# EAGLE design AirU_PoE (EAGLE 9.5.2)
COMPANY: ADAFRUIT INDUSTRIES; DRAWN: KTOWN; REV: B
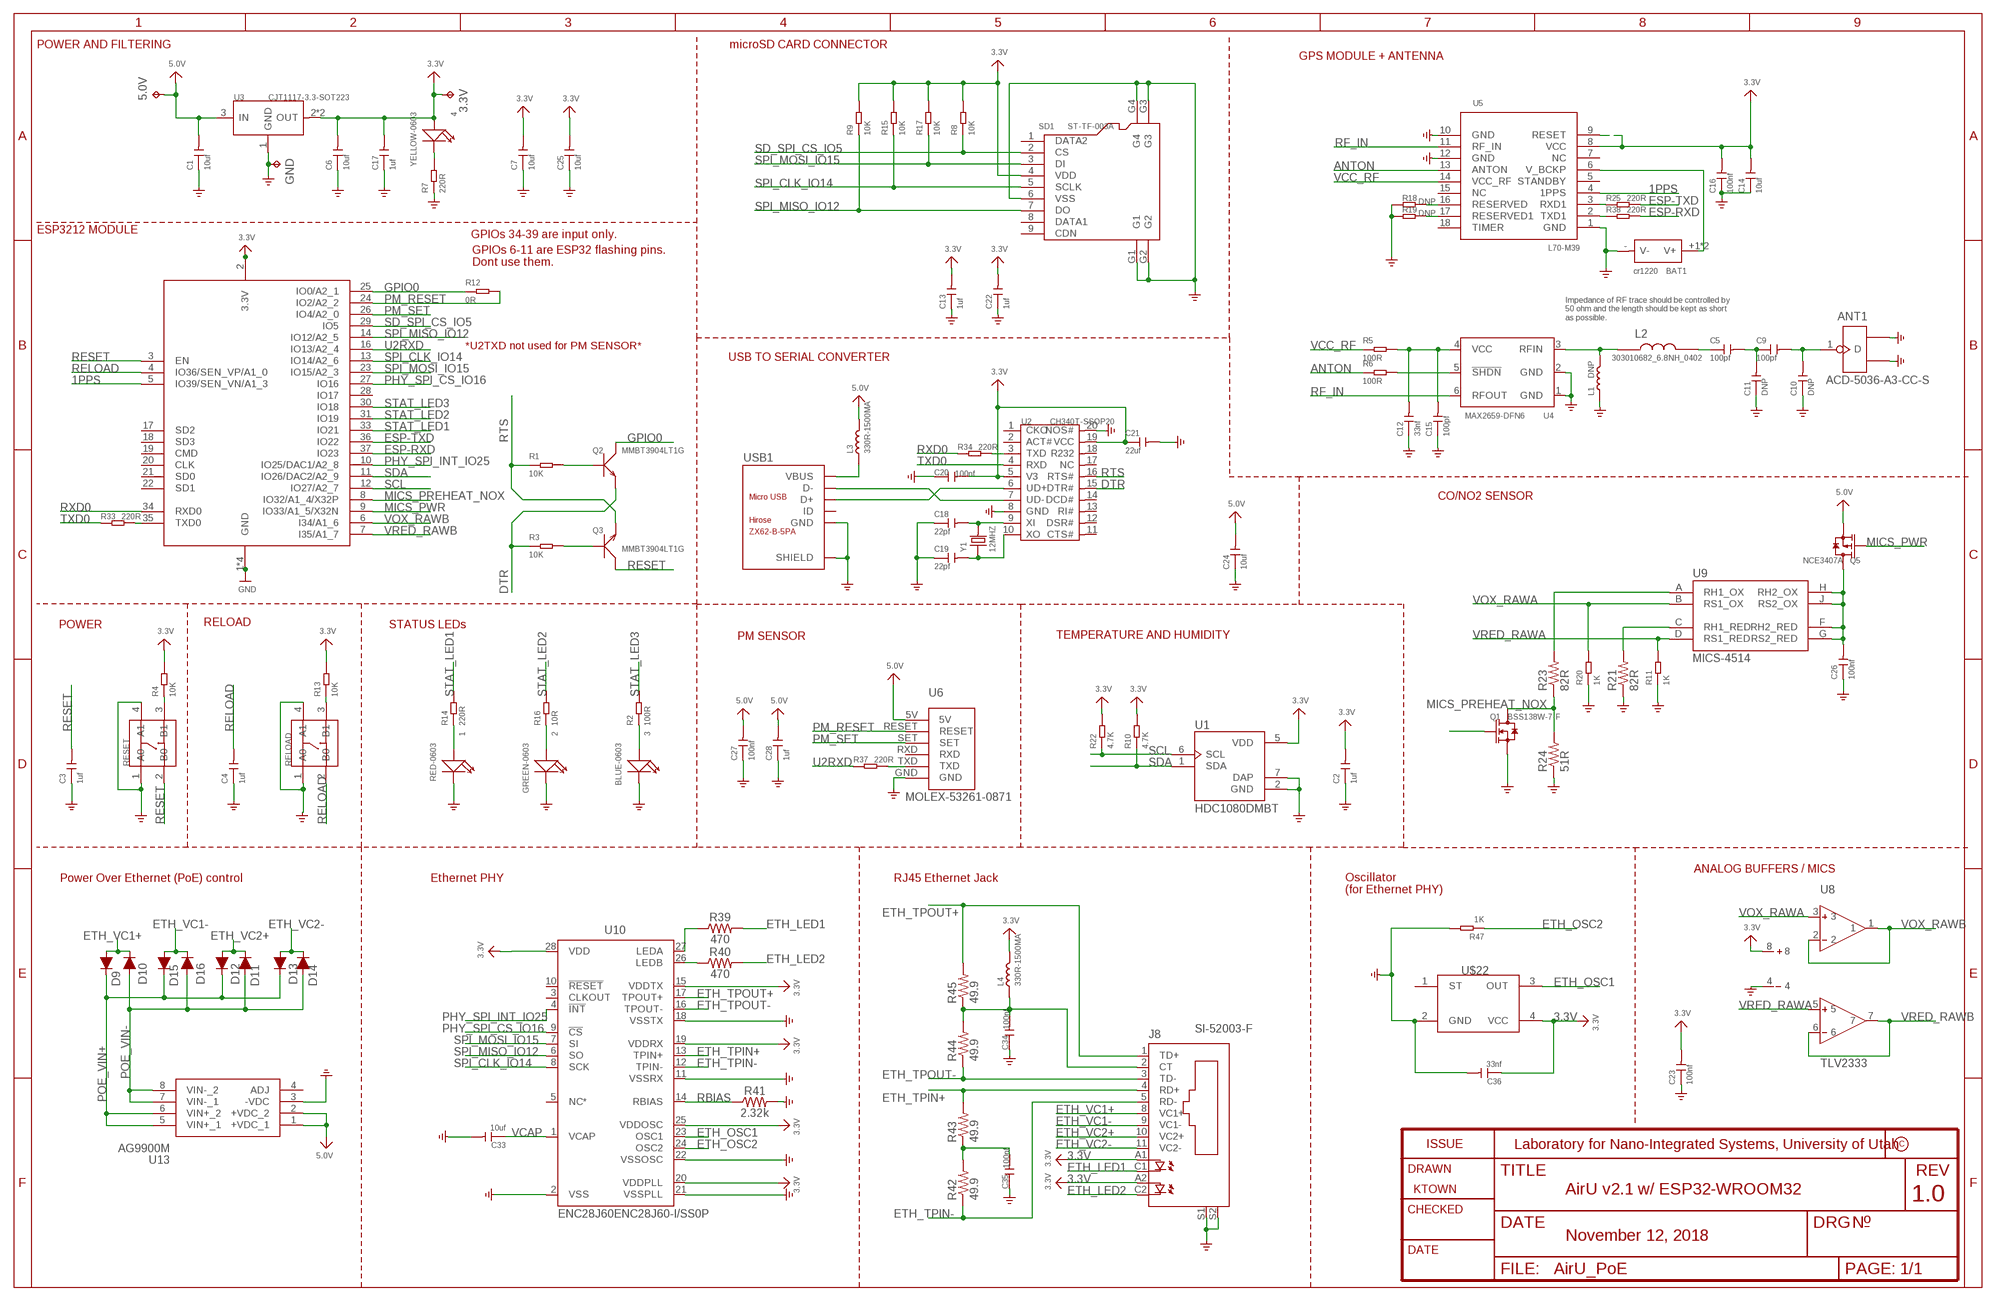
[diagram p0: schematic, sheet 1]
FRAME1 (FRAME_A4): COMPANY: TETRAD: SENSOR NETWORK SOLUTIONS, LLC; REV: 1.0

## Parts
1  RED-0603  LED-SMD-RED-DIFFUSED(0603)  [LED-0603]
2  GREEN-0603  SMD-LED-CLEAR-GREEN(0603)  [LED-0603]
3  BLUE-0603  SMD-LED-CLEAR-BLUE(0603)  [LED-0603]
3.3V  TPTP20SQ  [TP20SQ]
4  YELLOW-0603  SMD-LED-CLEAR-YELLOW(0603)  [LED-0603]
5.0V  TPTP20SQ  [TP20SQ]
ANT1  ACD-5036-A3-CC-S  ANTENNA-ACD5036  [ANT3-SMD-5.2X3.7X0.7MM]
BAT1  cr1220  DIP-BATTERY-CELL-HOLDER(1220)  [BAT2P-13.5-CR1220]
C1  10uf  CERAMIC-10UF-10V-10%-X5R(0603)  [C0603]
C2  1uf  CERAMIC-1UF-25V-10%-X7R(0603)  [C0603]
C3  1uf  CERAMIC-1UF-25V-10%-X7R(0603)  [C0603]
C4  1uf  CERAMIC-1UF-25V-10%-X7R(0603)  [C0603]
C5  100pf  CERAMIC-100PF-50V-5%-NPO(0603)  [C0603]
C6  10uf  CERAMIC-10UF-10V-10%-X5R(0603)  [C0603]
C7  10uf  CERAMIC-10UF-10V-10%-X5R(0603)  [C0603]
C9  100pf  CERAMIC-100PF-50V-5%-NPO(0603)  [C0603]
C10  DNP  CERAMIC-100PF-50V-5%-NPO(0603)  [C0603]
C11  DNP  CERAMIC-100PF-50V-5%-NPO(0603)  [C0603]
C12  33nf  CERAMIC-33NF-50V-10%-X7R(0603)  [C0603]
C13  1uf  CERAMIC-1UF-25V-10%-X7R(0603)  [C0603]
C14  10uf  CERAMIC-10UF-10V-10%-X5R(0603)  [C0603]
C15  100pf  CERAMIC-100PF-50V-5%-NPO(0603)  [C0603]
C16  100nf  CERAMIC-100NF-50V-10%-X7R(0603)  [C0603]
C17  1uf  CERAMIC-1UF-25V-10%-X7R(0603)  [C0603]
C18  22pf  CERAMIC-22PF-50V-5%-NPO(0603)  [C0603]
C19  22pf  CERAMIC-22PF-50V-5%-NPO(0603)  [C0603]
C20  100nf  CERAMIC-100NF-50V-10%-X7R(0603)  [C0603]
C21  22uf  CERAMIC-22UF-6.3V-20%-X5R(0805)  [C0805]
C22  1uf  CERAMIC-1UF-25V-10%-X7R(0603)  [C0603]
C23  100nf  CERAMIC-100NF-50V-10%-X7R(0603)  [C0603]
C24  10uf  CERAMIC-10UF-10V-10%-X5R(0603)  [C0603]
C25  10uf  CERAMIC-10UF-10V-10%-X5R(0603)  [C0603]
C26  100nf  CERAMIC-100NF-50V-10%-X7R(0603)  [C0603]
C27  100nf  CERAMIC-100NF-50V-10%-X7R(0603)  [C0603]
C28  1uf  CERAMIC-1UF-25V-10%-X7R(0603)  [C0603]
C33  10uf  CERAMIC-10UF-10V-10%-X5R(0603)  [C0603]
C34  100nf  CERAMIC-100NF-50V-10%-X7R(0603)  [C0603]
C35  100nf  CERAMIC-100NF-50V-10%-X7R(0603)  [C0603]
C36  33nf  CERAMIC-33NF-50V-10%-X7R(0603)  [C0603]
D9  250mA/100V  DIODE-BAS16J  [SOD-323]
D10  250mA/100V  DIODE-BAS16J  [SOD-323]
D11  250mA/100V  DIODE-BAS16J  [SOD-323]
D12  250mA/100V  DIODE-BAS16J  [SOD-323]
D13  250mA/100V  DIODE-BAS16J  [SOD-323]
D14  250mA/100V  DIODE-BAS16J  [SOD-323]
D15  250mA/100V  DIODE-BAS16J  [SOD-323]
D16  250mA/100V  DIODE-BAS16J  [SOD-323]
GND  TPTP20SQ  [TP20SQ]
J8  SI-52003-F  [SI-52003-F]
L1  DNP  INDUCTOR/FERRITE-BEAD-0201  [L0201]
L2  303010682_6.8NH_0402  [L0402]
L3  330R-1500MA  SMD-FERRITE-BEAD-330R-1500MA(0805)'0805'  [L0805]
L4  330R-1500MA  SMD-FERRITE-BEAD-330R-1500MA(0805)'0805'  [L0805]
Q1  BSS138W-7-F  SMD-MOSFET-N-CH-50V-200MA-BSS138W-7-F(SOT-23)  [SOT-23]
Q2  MMBT3904LT1G  SMD-TRANSISTORS-NPN-40V-200MA-MMBT3904LT1G(SOT-23)  [SOT-23]
Q3  MMBT3904LT1G  SMD-TRANSISTORS-NPN-40V-200MA-MMBT3904LT1G(SOT-23)  [SOT-23]
Q5  NCE3407A  SMD-MOSFET-P-CH-VDC=30V-ID=4.3A-NCE3407A(SOT-23)  [SOT-23]
R1  10K  SMD-RES-10K-1%-1/10W(0603)  [R0603]
R2  100R  SMD-RES-100R-5%-1/10W(0603)  [R0603]
R3  10K  SMD-RES-10K-1%-1/10W(0603)  [R0603]
R4  10K  SMD-RES-10K-1%-1/10W(0603)  [R0603]
R5  100R  SMD-RES-100R-5%-1/10W(0603)  [R0603]
R6  100R  SMD-RES-100R-5%-1/10W(0603)  [R0603]
R7  220R  SMD-RES-220R-5%-1/10W(0603)  [R0603]
R8  10K  SMD-RES-10K-1%-1/10W(0603)  [R0603]
R9  10K  SMD-RES-10K-1%-1/10W(0603)  [R0603]
R10  4.7K  SMD-RES-4.7K-5%-1/10W(0603)  [R0603]
R11  1K  SMD-RES-1K-1%-1/10W(0603)  [R0603]
R12  0R  SMD-RES-0R-5%-1/10W(0603)  [R0603]
R13  10K  SMD-RES-10K-1%-1/10W(0603)  [R0603]
R14  220R  SMD-RES-220R-5%-1/10W(0603)  [R0603]
R15  10K  SMD-RES-10K-1%-1/10W(0603)  [R0603]
R16  10R  SMD-RES-10R-5%-1/10W(0603)  [R0603]
R17  10K  SMD-RES-10K-1%-1/10W(0603)  [R0603]
R18  DNP  SMD-RES-10K-1%-1/10W(0603)  [R0603]
R19  DNP  SMD-RES-10K-1%-1/10W(0603)  [R0603]
R20  1K  SMD-RES-1K-1%-1/10W(0603)  [R0603]
R21  82R  R-US_R0603  [R0603]
R22  4.7K  SMD-RES-4.7K-5%-1/10W(0603)  [R0603]
R23  82R  R-US_R0603  [R0603]
R24  51R  R-US_R0603  [R0603]
R25  220R  SMD-RES-220R-5%-1/10W(0603)  [R0603]
R33  220R  SMD-RES-220R-5%-1/10W(0603)  [R0603]
R34  220R  SMD-RES-220R-5%-1/10W(0603)  [R0603]
R37  220R  SMD-RES-220R-5%-1/10W(0603)  [R0603]
R38  220R  SMD-RES-220R-5%-1/10W(0603)  [R0603]
R39  470  470OHM-0603-1/10W-1%  [0603]
R40  470  470OHM-0603-1/10W-1%  [0603]
R41  2.32k  2.2KOHM-0603-1/10W-1%  [0603]
R42  49.9  R-US_M0805  [M0805]
R43  49.9  R-US_M0805  [M0805]
R44  49.9  R-US_M0805  [M0805]
R45  49.9  R-US_M0805  [M0805]
R47  1K  SMD-RES-1K-1%-1/10W(0603)  [R0603]
RELOAD  DIP-SWITCH-TACTILE-SPST-NO/TS-1109(4P-D6.0MM)'TS-1109'  [SW4-6.0X6.0X5.0MM]
RESET  DIP-SWITCH-TACTILE-SPST-NO/TS-1109(4P-D6.0MM)'TS-1109'  [SW4-6.0X6.0X5.0MM]
SD1  ST-TF-003A  MICRO-SD-CARD-SOCKET-9P(ST-TF-003A)  [MICRO-SD9+4P-SMD-16.1X14.5X1.85MM]
U1  HDC1080DMBT  [SON100P300X300X80-7N]
U2  CH340T-SSOP20  INTERFACE-CH340T(SSOP20)  [SSOP20-0.65-7.6X5.2MM]
U3  CJT1117-3.3-SOT223  PMIC-CJT1117-3.3(SOT223)  [SOT-223]
U4  MAX2659-DFN6  AMPLIFIER-MAX2659  [DFN6-0.5-1.5X1.2X0.72MM]
U5  L70-M39  MOUDLE-GPS-L70-HARDWARE  [LGA18-1.1-9.7X10.1X2.5MM]
U6  MOLEX-53261-0871  [MOLEX-53261-0871]
U7  ESP32_WROOM32_SKINNY  [WROOM32_SKINNY]
U8  TLV2333  [TLV2333]
U9  MICS-4514  [MICS_10-SMD]
U10  ENC28J60ENC28J60-I/SS0P  [SOP65P780X200-28]
U13  AG9900M  [AG9900M]
U$22  SPXO25MHZ7050-4P  [DFN700X500X150-4N]
USB1  ZX62-B-5PA  MICRO-USB-SMD(ZX62-B-5PA)  [MICRO-USB5+6P-SMD-0.65-AB]
Y1  12MHZ  SMD-CRYSTAL-12MHZ-20PF-20PPM-40R(2P-5.0X3.2MM)  [X2-SMD-5.0X3.2X1.3MM]

## Nets
1PPS: U5.4(1PPS) U7.5(IO39/SEN_VN/A1_3)
3.3V: 3.3V.TP 4.+ C2.2 C6.2 C7.2 C13.2 C14.2 C16.2 C17.2 C20.2 C21.1 C22.2 C23.2 C25.2 C36.1 J8.A1 J8.A2 L4.2 R4.2 R8.2 R9.2 R10.2 R13.2 R15.2 R17.2 R22.2 SD1.4(VDD) U1.5(VDD) U2.5(V3) U2.19(VCC) U3.2(OUT) U3.TER(OUT) U5.8(VCC) U5.9(RESET) U7.2(3.3V) U8.8 U10.15(VDDTX) U10.19(VDDRX) U10.20(VDDPLL) U10.25(VDDOSC) U10.28(VDD) U$22.4(VCC)
5.0V: 5.0V.TP C1.2 C24.2 C27.2 C28.2 L3.2 Q5.2(S) U3.3(IN) U6.5V U13.1(+VDC_1) U13.2(+VDC_2)
ANTON: R6.1 U5.13(ANTON)
DTR: Q2.2(E) R3.1 U2.15(DTR#)
ESP-RXD: R38.2 U7.37(IO23)
ESP-TXD: R25.2 U7.36(IO22)
ETH_LED1: J8.C1 R39.2
ETH_LED2: J8.C2 R40.2
ETH_OSC1: U10.23(OSC1) U$22.3(OUT)
ETH_OSC2: R47.1 U10.24(OSC2)
ETH_TPIN+: J8.4(RD+) R43.2 U10.13(TPIN+)
ETH_TPIN-: J8.5(RD-) R42.1 U10.12(TPIN-)
ETH_TPOUT+: J8.1(TD+) R45.2 U10.17(TPOUT+)
ETH_TPOUT-: J8.3(TD-) R44.1 U10.16(TPOUT-)
ETH_VC1+: D9.A D10.C J8.8(VC1+)
ETH_VC1-: D15.A D16.C J8.9(VC1-)
ETH_VC2+: D11.C D12.A J8.10(VC2+)
ETH_VC2-: D13.A D14.C J8.11(VC2-)
GND: 1.- 2.- 3.- ANT1.2(GND1) ANT1.3(GND2) BAT1.-(V-) C1.1 C2.1 C3.1 C4.1 C6.1 C7.1 C10.1 C11.1 C12.1 C13.1 C14.1 C15.1 C16.1 C17.1 C18.1 C19.1 C20.1 C21.2 C22.1 C23.1 C24.1 C25.1 C26.1 C27.1 C28.1 C33.2 C34.1 C35.1 C36.2 GND.TP J8.S1 J8.S2 L1.1 Q1.2(S) R7.1 R11.1 R18.1 R19.1 R20.1 R21.1 R24.1 R41.2 R47.2 RELOAD.1(A0) RELOAD.4(A1) RESET.1(A0) RESET.4(A1) SD1.6(VSS) SD1.G1 SD1.G2 SD1.G3 SD1.G4 U1.2(GND) U1.7(DAP) U2.8(GND) U2.20(NOS#) U3.1(GND) U4.1(GND) U4.2(GND) U5.1(GND) U5.10(GND) U5.12(GND) U6.GND U7.1(GND) U7.15(GND) U7.38(GND) U7.P$1(GND) U8.4 U10.2(VSS) U10.11(VSSRX) U10.18(VSSTX) U10.21(VSSPLL) U10.22(VSSOSC) U13.3(-VDC) U$22.2(GND) USB1.5(GND) USB1.P1(SHIELD) USB1.P2(SHIELD) USB1.P3_1(SHIELD) USB1.P3_2(SHIELD) USB1.P3_3(SHIELD) USB1.P4_1(SHIELD) USB1.P4_2(SHIELD) USB1.P4_3(SHIELD) USB1.P5(SHIELD) USB1.P6(SHIELD) ; supply symbol labelled GND_POWER
GPIO0: Q2.3(C) R12.1 U7.25(IO0/A2_1)
LEDA: R39.1 U10.27(LEDA)
LEDB: R40.1 U10.26(LEDB)
MICS_PREHEAT_NOX: Q1.1(G) U7.8(IO32/A1_4/X32P)
MICS_PWR: Q5.1(G) U7.9(IO33/A1_5/X32N)
N$1: 2.+ R16.1
N$2: R21.2 U9.C(RH1_RED)
N$3: C5.2 C9.1 C11.2
N$4: ANT1.1(D) C9.2 C10.2
N$5: L1.2 L2.P$1 U4.3(RFIN)
N$6: R23.2 U9.A(RH1_OX)
N$7: 1.+ R14.1
N$8: C5.1 L2.P$2
N$9: R6.2 U4.5(!SHDN)
N$10: C12.2 C15.2 R5.2 U4.4(VCC)
N$11: R18.2 U5.16(RESERVED)
N$12: Q3.1(B) R3.2
N$13: Q2.1(B) R1.2
N$14: R19.2 U5.17(RESERVED1)
N$22: 3.+ R2.1
N$23: Q1.3(D) R23.1 R24.2
N$24: C26.2 Q5.3(D) U9.F(RH2_RED) U9.G(RS2_RED) U9.H(RH2_OX) U9.J(RS2_OX)
N$25: 4.- R7.2
N$26: U2.7(UD-) USB1.2(D-)
N$27: U2.6(UD+) USB1.3(D+)
N$28: C18.2 U2.9(XI) Y1.2
N$29: C19.2 U2.10(XO) Y1.1
N$30: R34.2 U2.3(TXD)
N$33: R33.2 U7.35(TXD0)
N$36: R37.2 U6.TXD
N$37: R13.1 RELOAD.3(B1)
N$38: R4.1 RESET.3(B1)
N$43: C35.2 R42.2 R43.1
N$46: C34.2 J8.2(CT) L4.1 R44.2 R45.1
PHY_SPI_CS_IO16: U7.27(IO16) U10.9(!CS)
PHY_SPI_INT_IO25: U7.10(IO25/DAC1/A2_8) U10.4(!INT)
PM_RESET: R12.2 U6.RESET U7.24(IO2/A2_2)
PM_SET: U6.SET U7.26(IO4/A2_0)
POE_VIN+: D9.C D12.C D13.C D15.C U13.5(VIN+_1) U13.6(VIN+_2)
POE_VIN-: D10.A D11.A D14.A D16.A U13.7(VIN-_1) U13.8(VIN-_2)
RBIAS: R41.1 U10.14(RBIAS)
RELOAD: C4.2 RELOAD.2(B0) U7.4(IO36/SEN_VP/A1_0)
RESET: C3.2 Q3.3(C) RESET.2(B0) U7.3(EN)
RF_IN: U4.6(RFOUT) U5.11(RF_IN)
RTS: Q3.2(E) R1.1 U2.16(RTS#)
RXD0: R34.1 U7.34(RXD0)
SCL: R22.1 U1.6(SCL) U7.12(IO27/A2_7)
SD_SPI_CS_IO5: R8.1 SD1.2(CS) U7.29(IO5)
SDA: R10.1 U1.1(SDA) U7.11(IO26/DAC2/A2_9)
SPI_CLK_IO14: R15.1 SD1.5(SCLK) U7.13(IO14/A2_6) U10.8(SCK)
SPI_MISO_IO12: R9.1 SD1.7(DO) U7.14(IO12/A2_5) U10.6(SO)
SPI_MOSI_IO15: R17.1 SD1.3(DI) U7.23(IO15/A2_3) U10.7(SI)
STAT_LED1: R14.2 U7.33(IO21)
STAT_LED2: R16.2 U7.31(IO19)
STAT_LED3: R2.2 U7.30(IO18)
TXD0: R33.1 U2.4(RXD)
U1RXD: R25.1 U5.3(RXD1)
U1TXD: R38.1 U5.2(TXD1)
U2RXD: R37.1 U7.16(IO13/A2_4)
V_BCKP: BAT1.+1(V+) BAT1.+2(V+) U5.6(V_BCKP)
VBUS: L3.1 USB1.1(VBUS)
VCAP: C33.1 U10.1(VCAP)
VCC_RF: R5.1 U5.14(VCC_RF)
VOX_RAWA: R20.2 U8.3 U9.B(RS1_OX)
VOX_RAWB: U7.6(I34/A1_6) U8.1 U8.2
VRED_RAWA: R11.2 U8.5 U9.D(RS1_RED)
VRED_RAWB: U7.7(I35/A1_7) U8.6 U8.7
Unconnected: SD1.1(DATA2) SD1.8(DATA1) SD1.9(CDN) U2.1(CKO) U2.2(ACT#) U2.11(CTS#) U2.12(DSR#) U2.13(RI#) U2.14(DCD#) U2.17(NC) U2.18(R232) U5.5(STANDBY) U5.7(NC) U5.15(NC) U5.18(TIMER) U6.RXD U7.17(SD2) U7.18(SD3) U7.19(CMD) U7.20(CLK) U7.21(SD0) U7.22(SD1) U7.28(IO17) U10.3(CLKOUT) U10.5(NC*) U10.10(!RESET) U13.4(ADJ) U$22.1(ST) USB1.4(ID)

## Notes on the sheet
- POWER AND FILTERING | microSD CARD CONNECTOR
- GPS MODULE + ANTENNA
- ESP3212 MODULE
- GPIOs 34-39 are input only.
- GPIOs 6-11 are ESP32 flashing pins.
  Dont use them.
- Impedance of RF trace should be controlled by 
  50 ohm and the length should be kept as short 
  as possible.
- *U2TXD not used for PM SENSOR*
- USB TO SERIAL CONVERTER
- CO/NO2 SENSOR
- POWER | RELOAD | STATUS LEDs
- PM SENSOR | TEMPERATURE AND HUMIDITY
- ANALOG BUFFERS / MICS
- Power Over Ethernet (PoE) control | Ethernet PHY | RJ45 Ethernet Jack
- Oscillator
  (for Ethernet PHY)
- Laboratory for Nano-Integrated Systems, University of Utah
- AirU v2.1 w/ ESP32-WROOM32
- November 12, 2018

## Library data of the parts
1 = Seeed-LED:LED-SMD-RED-DIFFUSED(0603): 304090042; MPN: 19-217-R6C-AL1M2VY-3T
2 = Seeed-LED:SMD-LED-CLEAR-GREEN(0603): 304090043; MPN: 19-217-G7C-AN1P2-3T
3 = Seeed-LED:SMD-LED-CLEAR-BLUE(0603): 304090045; MPN: 19-217-BHC-ZL1M2RY-3T
3.3V 5.0V GND = testpad:TP: Test pad
4 = Seeed-LED:SMD-LED-CLEAR-YELLOW(0603): 304090044; MPN: 19-217-Y5C-AM1N1VY-3T
ANT1 = Connector-new:ANTENNA-ACD5036; MPN: ACD-5036-A3-CC-S
BAT1 = Seeed-Connector:DIP-BATTERY-CELL-HOLDER(1220): 320170002
C1 C6 C7 C14 C24 C25 C33 = Seeed-Capacitor:CERAMIC-10UF-10V-10%-X5R(0603): 302010103; MPN: CC0603KRX5R6BB106
C2-C4 C13 C17 C22 C28 = Seeed-Capacitor:CERAMIC-1UF-25V-10%-X7R(0603): 302010139; MPN: CC0603KRX7R8BB105
C5 C9 C15 = Seeed-Capacitor:CERAMIC-100PF-50V-5%-NPO(0603): 302010076; MPN: CC0603JRNPO9BN101
C10 C11 = Seeed-Capacitor:CERAMIC-100PF-50V-5%-NPO(0603): 302010076; MPN: CC0603JRNPO9BN101; VALUE: 100pf
C12 C36 = Seeed-Capacitor:CERAMIC-33NF-50V-10%-X7R(0603): 302010088; MPN: CC0603KRX7R9BB333
C16 C20 C23 C26 C27 C34 C35 = Seeed-Capacitor:CERAMIC-100NF-50V-10%-X7R(0603): 302010138; MPN: CC0603KRX7R9BB104
C18 C19 = Seeed-Capacitor:CERAMIC-22PF-50V-5%-NPO(0603): 302010143; MPN: CC0603JRNPO9BN220
C21 = Seeed-Capacitor:CERAMIC-22UF-6.3V-20%-X5R(0805): 302010171; MPN: CC0805MKX5R5BB226
D9-D16 = SparkFun-DiscreteSemi:DIODE: Diode These are standard reverse protection diodes and small signal diodes. SparkFun Products: SparkFun SparkPunk Sound Kit <https://www.sparkfun.com/products/11177> SparkFun ESP8266 Thing <https://www.sparkfun.com/products/13231>; PROD_ID: DIO-09646
J8 = SI-52003-F:SI-52003-F: Ethernet Connector MagJack (R) Source: www.stewartconnector.com .. si-50170.pdf; AVAILABILITY: Unavailable; DESCRIPTION: Conn RJ-45 F 8 POS Solder RA Thru-Hole 12 Terminal 1 Port; MF: Stewart Connector; MP: SI-52003-F; PACKAGE: None; PRICE: None
L1 = Discrete-new:INDUCTOR/FERRITE-BEAD
L2 = Seeed-OPL-2017-01-Inductor-Akita:303010682_6.8NH_0402: Murata;LQW15AN6N8G00D, SMD Inductor 6.8nH-2%-700mA;0402, SKU: 303010682
L3 L4 = Seeed-Inductor:SMD-FERRITE-BEAD-330R-1500MA(0805): 303030006; MPN: BLM21PG331SN1D
Q1 = Seeed-Transistor:SMD-MOSFET-N-CH-50V-200MA-BSS138W-7-F(SOT-23): 305030000; MPN: BSS138W-7-F
Q2 Q3 = Seeed-Transistor:SMD-TRANSISTORS-NPN-40V-200MA-MMBT3904LT1G(SOT-23): 305010013; MPN: MMBT3904LT1G
Q5 = Seeed-Transistor:SMD-MOSFET-P-CH-VDC=30V-ID=4.3A-NCE3407A(SOT-23): 305030010; MPN: NCE3407A
R1 R3 R4 R8 R9 R13 R15 R17 = Seeed-Resistor:SMD-RES-10K-1%-1/10W(0603): 301010299; MPN: RC0603FR-0710KL
R2 R5 R6 = Seeed-Resistor:SMD-RES-100R-5%-1/10W(0603): 301010090; MPN: RC0603JR-07100RL
R7 R14 R25 R33 R34 R37 R38 = Seeed-Resistor:SMD-RES-220R-5%-1/10W(0603): 301010163; MPN: RC0603JR-07220RL
R10 R22 = Seeed-Resistor:SMD-RES-4.7K-5%-1/10W(0603): 301010290; MPN: RC0603JR-074K7L
R11 R20 R47 = Seeed-Resistor:SMD-RES-1K-1%-1/10W(0603): 301010298; MPN: RC0603FR-071KL
R12 = Seeed-Resistor:SMD-RES-0R-5%-1/10W(0603): 301010292; MPN: RC0603JR-070RL
R16 = Seeed-Resistor:SMD-RES-10R-5%-1/10W(0603): 301010096; MPN: RC0603JR-0710RL
R18 R19 = Seeed-Resistor:SMD-RES-10K-1%-1/10W(0603): 301010299; MPN: RC0603FR-0710KL; VALUE: 10K
R21 R23 R24 = rcl:R-US_: RESISTOR, American symbol; SPICEPREFIX: R
R39 R40 = SparkFun-Resistors:470OHM: 470Ω resistor A resistor is a passive two-terminal electrical component that implements electrical resistance as a circuit element. Resistors act to reduce current flow, and, at the same time, act to lower voltage levels within circuits. - Wikipedia; PROD_ID: RES-07869
R41 = SparkFun-Resistors:2.2KOHM: 2.2kΩ resistor A resistor is a passive two-terminal electrical component that implements electrical resistance as a circuit element. Resistors act to reduce current flow, and, at the same time, act to lower voltage levels within circuits. - Wikipedia; PROD_ID: RES-08272; VALUE: 2.2k
R42-R45 = BeagleBone_Black_Wireless:R-US_: RESISTOR, American symbol
RELOAD RESET = Seeed-Switch:DIP-SWITCH-TACTILE-SPST-NO/TS-1109(4P-D6.0MM): 311020024
SD1 = Seeed-Connector:MICRO-SD-CARD-SOCKET-9P(ST-TF-003A): 320090000; MPN: ST-TF-003A
U1 = HDC1080DMBT_TITempHum:HDC1080DMBT: HDC1080 Low Power, High Accuracy Digital Humidity Sensor with Temperature Sensor 6-WSON -40 to 125; DESCRIPTION: HDC1080 Low Power, High Accuracy Digital Humidity Sensor with Temperature Sensor 6-WSON -40 to 125; DIGI-KEY_PART_NUMBER: 296-43864-1-ND; DIGI-KEY_PURCHASE_URL: https://www.digikey.com/product-detail/en/texas-instruments/HDC1080DMBT/296-43864-1-ND/5878615?utm_source=snapeda&utm_medium=aggregator&utm_campaign=symbol; MF: Texas Instruments; MP: HDC1080DMBT; PACKAGE: WDFN-6 Texas Instruments
U2 = Seeed-IC:INTERFACE-CH340T(SSOP20): 310070026; MPN: CH340T
U3 = Seeed-IC:PMIC-CJT1117-3.3(SOT223): 310030097; MPN: CJT1117-3.3
U4 = IC-new:AMPLIFIER-MAX2659: GPS/GNSS Low-Noise Amplifier; MPN: MAX2659
U5 = moudle-new:MOUDLE-GPS-L70-HARDWARE: L70 GPS module; MPN: L70; VALUE: L70
U6 = Molex_53261_0871_Connector:MOLEX-53261-0871
U7 = microbuilder:ESP32_WROOM32
U8 = tlv2333:TLV2333
U9 = MICS-4514:MICS-4514: Metal oxide MEMS carbon monoxide (CO) and NOx sensor in an SMD package.; AVAILABILITY: Unavailable; MF: Amphenol; MP: MICS-4514; PACKAGE: None; PRICE: 11.82 USD
U10 = ENC28J60QFN:ENC28J60: Stand-Alone Ethernet Controller with SPI Interface Source: http://ww1.microchip.com/downloads/en/DeviceDoc/39662c.pdf
U13 = Ag9900M:AG9900M: Ultra Miniature PoE Module Source: Datasheet <https://www.silvertel.com/images/datasheets/Ag9900M-datasheet-ultra-miniature-isolated-Power-over-Ethernet-POE-module.pdf>; DESCRIPTION: Ultra Miniature PoE Module; HEIGHT: 13mm; MANUFACTURER_NAME: Silvertel; MANUFACTURER_PART_NUMBER: Ag9900M
U$22 = 25MHZ_seeed:SPXO25MHZ7050-4P
USB1 = Seeed-Connector:MICRO-USB-SMD(ZX62-B-5PA): 320010005; MPN: ZX62-B-5PA
Y1 = Seeed-Crystal Oscillator:SMD-CRYSTAL-12MHZ-20PF-20PPM-40R(2P-5.0X3.2MM): 306010047; MPN: 5032/2P

## Board
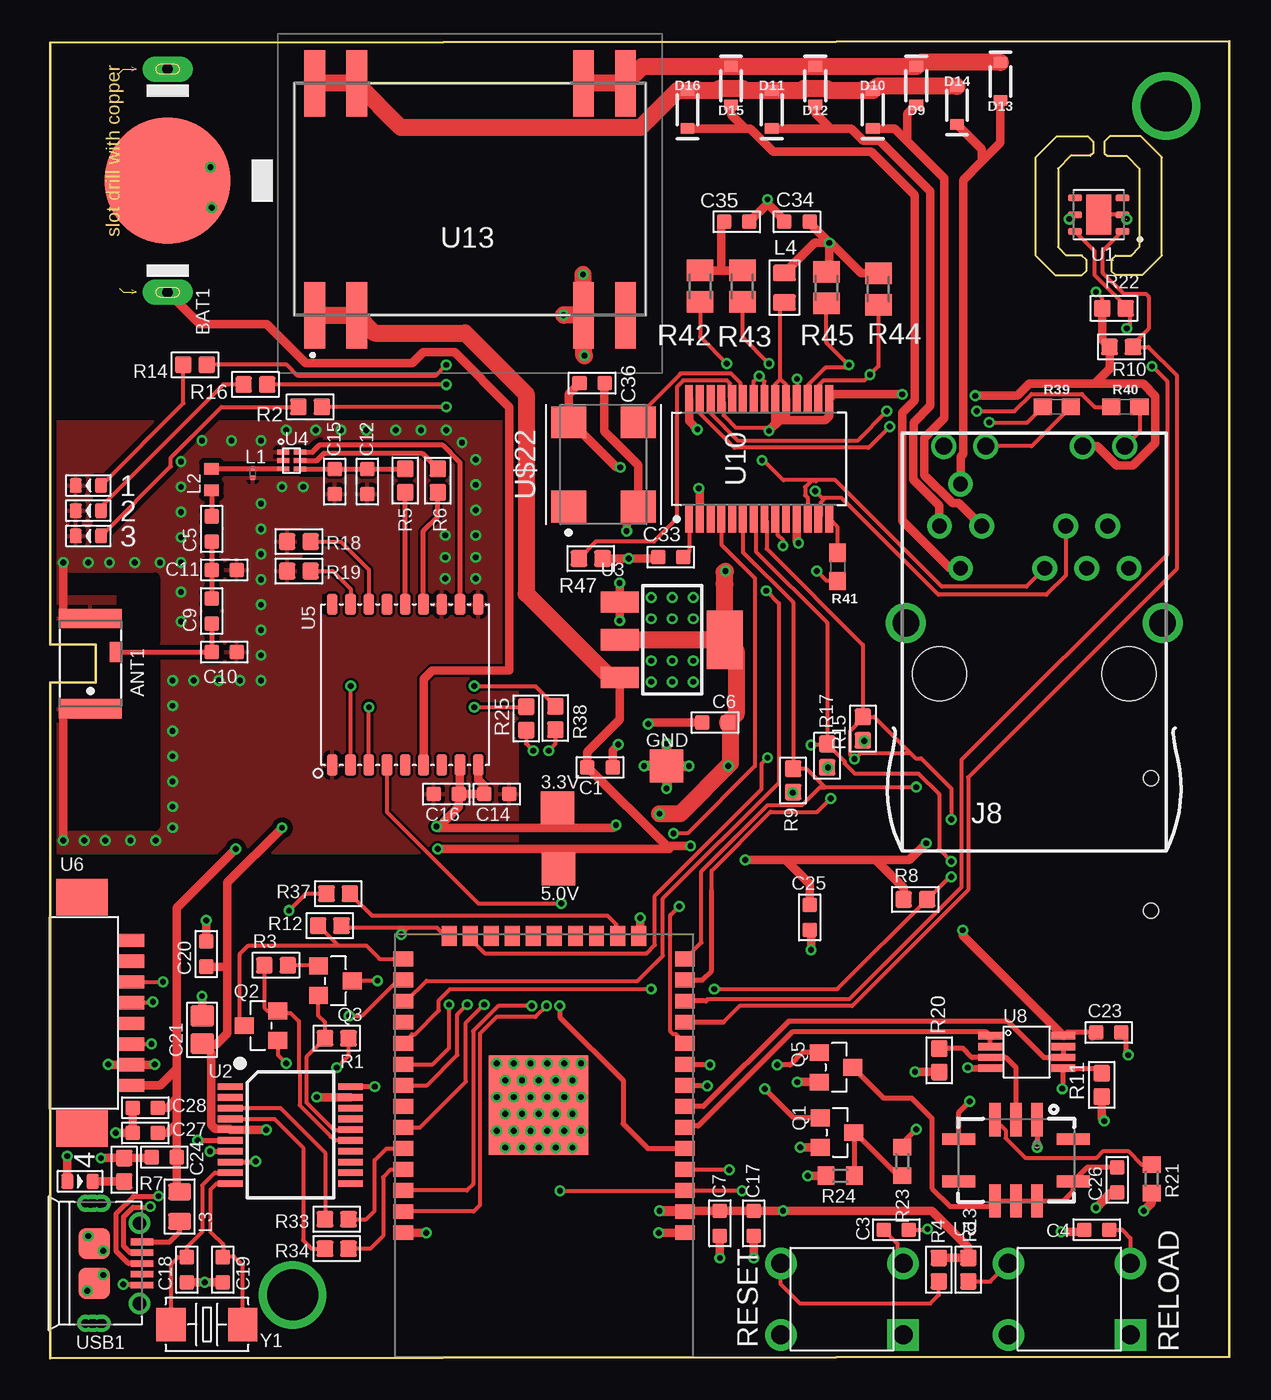
[diagram p1: board, top side]
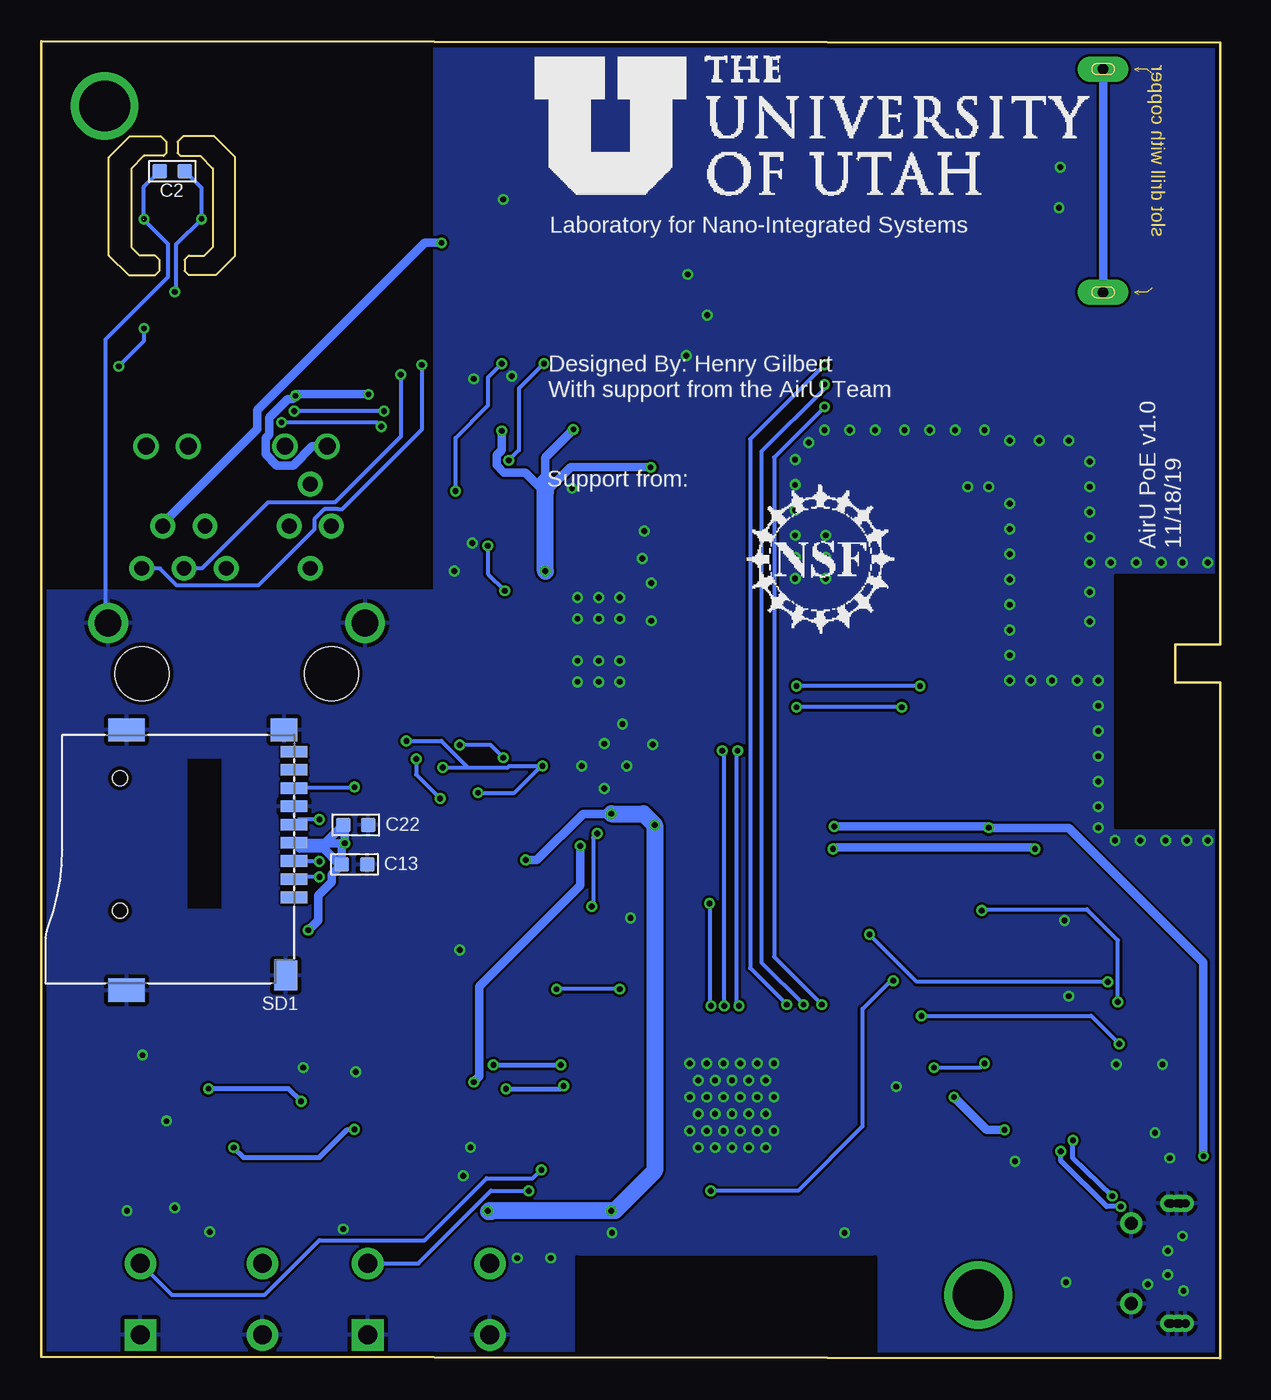
[diagram p2: board, bottom side, seen from below]

Size 71.12 x 79.46 mm. Coordinates in mm from the lower left corner, seen from the top.
Outline: 0,0 71.12,0.09 71.12,79.46 0,79.38 0,43.05 2.73,43.05 2.73,40.77 0,40.77 0,0
Outline: 63.58,73.4 63.58,72.72 63.75,72.55 64.93,72.55 65.69,71.79 65.69,67.05 65.19,66.54 64.26,66.54 64,66.29 64,65.61 64.26,65.36 65.86,65.36 67.05,66.54 67.05,72.47 65.78,73.74 63.92,73.74 63.58,73.4
Outline: 62.9,73.4 62.9,72.72 62.73,72.55 61.55,72.55 60.78,71.79 60.78,67.05 61.29,66.54 62.22,66.54 62.48,66.29 62.48,65.61 62.22,65.36 60.62,65.36 59.43,66.54 59.43,72.47 60.7,73.74 62.56,73.74 62.9,73.4
Copper layers (1*16): Top 0.035mm / dielectric 1.5mm / Bottom 0.035mm
Design rules "SeeedStudio_2layer_DRU_no_angle_20140221": minimum track width 6mil, minimum drill 12mil, track to track 6mil, track to pad 6mil, pad to pad 6mil, via to via 6mil, smd to smd 0mil, copper to edge 10mil, drill to drill 10mil, minimum pad ring 10mil, minimum via ring 6mil, stop-mask expansion 2mil, vias tented up to drill 100mil, thermal gap 10mil
tRestrict: area 20.8,0.1 to 38.8,6.1
bRestrict: area 20.8,0.1 to 38.8,6.1; area 0,32.1 to 6.3,47.1; area 0,32 to 6.3,47.2

### Footprints (pad centres in the part's own frame; a part is rotated, then mirrored left to right if it is on the bottom)
LED-0603 = smd 0.762 x 0.889: + -0.762,0; - 0.762,0
TP20SQ = smd 2 x 2: TP 0,0
ANT3-SMD-5.2X3.7X0.7MM = smd 0.75 x 1.2: 1 1.525,0.7 | smd 3.8 x 1.15: 2 0,2.725; 3 0,-2.725
BAT2P-13.5-CR1220 = drill 0.635 pad 1.524 long: +1 6.731,0; +2 -6.731,0 | smd 7.62 x 7.62: - 0,0
C0603 = smd 0.889 x 0.889: 1 0,0.762; 2 0,-0.762
C0805 = smd 1.397 x 1.27: 1 0,0.835; 2 0,-0.835
SOD-323 = smd 0.63 x 0.83: A 1.15,0; C -1.15,0
SI-52003-F = drill 0.9 pad 1.5: 1 5.715,3.302; 2 4.445,5.842; 3 3.175,3.302; 4 1.905,5.842; 5 0.635,3.302; 8 -3.175,5.842; 9 -4.445,3.302; 10 -5.715,5.842; 11 -4.445,8.382 | drill 1.016 pad 1.5: A1 -5.461,10.668; A2 2.921,10.668; C1 -2.921,10.668; C2 5.461,10.668 | drill 1.6 pad 2.2: S1 -7.747,0; S2 7.747,0 | hole 3.251: -5.715,-3.048; 5.715,-3.048
L0201 = smd 0.279 x 0.318: 1 -0.279,0; 2 0.279,0
L0402 = smd 0.7 x 0.9: P$1 -0.65,0; P$2 0.65,0
L0805 = smd 1.016 x 1.397: 1 -0.889,0; 2 0.889,0
SOT-23 = smd 1.016 x 1.143: 1 -0.889,-1.016; 2 0.889,-1.016; 3 0,1.016
R0603 = smd 1.016 x 1.016: 1 0,0.708; 2 0,-0.708
R0603' = smd 1 x 1.1: 1 -0.85,0; 2 0.85,0
0603 = smd 1.1 x 1: 1 -0.85,0; 2 0.85,0
M0805 = smd 1.3 x 1.6: 1 -0.95,0; 2 0.95,0
SW4-6.0X6.0X5.0MM = drill 1.143 pad 1.905 square: 1 -3.683,2.159 | drill 1.143 pad 1.905: 2 -3.683,-2.159; 3 3.683,-2.159; 4 3.683,2.159
MICRO-SD9+4P-SMD-16.1X14.5X1.85MM = smd 1.6 x 0.7: 1 0,2.25; 2 0,1.15; 3 0,0.05; 4 0,-1.05; 5 0,-2.15; 6 0,-3.25; 7 0,-4.35; 8 0,-5.45; 9 0,-6.55 | smd 1.6 x 1.4: G1 0.6,-7.85 | smd 2.2 x 1.4: G2 10.1,-7.85; G3 10.1,7.85 | smd 1.4 x 1.8: G4 0.5,6.95 | hole 0.9: 10.5,-4.95; 10.5,3.05
SON100P300X300X80-7N = smd 0.86 x 0.42: 1 -1.435,1; 2 -1.435,0; 3 -1.435,-1; 4 1.435,-1; 5 1.435,0; 6 1.435,1 | smd 1.5 x 2.4: 7 0,0
SSOP20-0.65-7.6X5.2MM = smd 0.4 x 1.5: 1 -2.925,-3.625; 2 -2.275,-3.625; 3 -1.625,-3.625; 4 -0.975,-3.625; 5 -0.325,-3.625; 6 0.325,-3.625; 7 0.975,-3.625; 8 1.625,-3.625; 9 2.275,-3.625; 10 2.925,-3.625; 11 2.925,3.625; 12 2.275,3.625; 13 1.625,3.625; 14 0.975,3.625; 15 0.325,3.625; 16 -0.325,3.625; 17 -0.975,3.625; 18 -1.625,3.625; 19 -2.275,3.625; 20 -2.925,3.625
SOT-223 = smd 1.27 x 2.286: 1 -2.286,-3.175; 2 0,-3.175; 3 2.286,-3.175 | smd 3.556 x 2.159: TER 0,3.175
DFN6-0.5-1.5X1.2X0.72MM = smd 0.3 x 0.75: 1 -0.5,-0.5; 2 0,-0.5; 3 0.5,-0.5; 4 0.5,0.5; 5 0,0.5; 6 -0.5,0.5
LGA18-1.1-9.7X10.1X2.5MM = smd 1.27 x 0.635: 1 4.85,-4.4; 2 4.85,-3.3; 3 4.85,-2.2; 4 4.85,-1.1; 5 4.85,0; 6 4.85,1.1; 7 4.85,2.2; 8 4.85,3.3; 9 4.85,4.4; 10 -4.85,4.4; 11 -4.85,3.3; 12 -4.85,2.2; 13 -4.85,1.1; 14 -4.85,0; 15 -4.85,-1.1; 16 -4.85,-2.2; 17 -4.85,-3.3; 18 -4.85,-4.4
MOLEX-53261-0871 = smd 0.8 x 1.6: 5V 4.375,0.8; GND 3.125,0.8; NC@1 -4.375,0.8; NC@2 -3.125,0.8; RESET -1.875,0.8; RXD 0.625,0.8; SET 1.875,0.8; TXD -0.625,0.8 | smd 2.2 x 3.1: NC@3 -6.975,-2.16; NC@4 6.975,-2.16
WROOM32_SKINNY = smd 1.2 x 0.9: 1 -8.5,5; 2 -8.5,3.73; 3 -8.5,2.46; 4 -8.5,1.19; 5 -8.5,-0.08; 6 -8.5,-1.35; 7 -8.5,-2.62; 8 -8.5,-3.89; 9 -8.5,-5.16; 10 -8.5,-6.43; 11 -8.5,-7.7; 12 -8.5,-8.97; 13 -8.5,-10.24; 14 -8.5,-11.51; 25 8.5,-11.51; 26 8.5,-10.24; 27 8.5,-8.97; 28 8.5,-7.7; 29 8.5,-6.43; 30 8.5,-5.16; 31 8.5,-3.89; 32 8.5,-2.62; 33 8.5,-1.35; 34 8.5,-0.08; 35 8.5,1.19; 36 8.5,2.46; 37 8.5,3.73; 38 8.5,5 | smd 0.9 x 1.2: 15 -5.7,-12.9; 16 -4.43,-12.9; 17 -3.16,-12.9; 18 -1.89,-12.9; 19 -0.62,-12.9; 20 0.65,-12.9; 21 1.92,-12.9; 22 3.19,-12.9; 23 4.46,-12.9; 24 5.73,-12.9 | smd 6 x 6: P$1 0.34,-2.7
TLV2333 = smd 1.45 x 0.45: 1 0.725,2.175; 2 0.725,1.525; 3 0.725,0.875; 4 0.725,0.225; 5 5.125,0.225; 6 5.125,0.875; 7 5.125,1.525; 8 5.125,2.175
MICS_10-SMD = smd 0.7 x 2: A 1.27,2.45; B 0,2.45; C -1.27,2.45; F -1.27,-2.45; G 0,-2.45; H 1.27,-2.45 | smd 2 x 0.7: D -3.45,1.27; E -3.45,-1.27; J 3.45,-1.27; K 3.45,1.27
SOP65P780X200-28 = smd 1.702 x 0.475: 1 -3.603,4.225; 2 -3.603,3.575; 3 -3.603,2.925; 4 -3.603,2.275; 5 -3.603,1.625; 6 -3.603,0.975; 7 -3.603,0.325; 8 -3.603,-0.325; 9 -3.603,-0.975; 10 -3.603,-1.625; 11 -3.603,-2.275; 12 -3.603,-2.925; 13 -3.603,-3.575; 14 -3.603,-4.225; 15 3.603,-4.225; 16 3.603,-3.575; 17 3.603,-2.925; 18 3.603,-2.275; 19 3.603,-1.625; 20 3.603,-0.975; 21 3.603,-0.325; 22 3.603,0.325; 23 3.603,0.975; 24 3.603,1.625; 25 3.603,2.275; 26 3.603,2.925; 27 3.603,3.575; 28 3.603,4.225
AG9900M = smd 1.25 x 4: 1 -9.375,-7; 2 -6.835,-7; 3 6.835,-7; 4 9.375,-7; 5 9.375,7; 6 6.835,7; 7 -6.835,7; 8 -9.375,7
DFN700X500X150-4N = smd 1.912 x 2.112: 1 -2.54,2.1; 2 -2.54,-2.1; 3 2.54,-2.1; 4 2.54,2.1
MICRO-USB5+6P-SMD-0.65-AB = smd 0.4 x 1.35: 1 -1.3,2.875; 2 -0.65,2.875; 3 0,2.875; 4 0.65,2.875; 5 1.3,2.875 | smd 1.9 x 1.9: P1 -1.2,0; P2 1.2,0 | drill 0.508 pad 1.016: P3_1 -3.625,-0.533; P3_2 -3.625,-0.025; P3_3 -3.625,0.483; P4_1 3.625,-0.533; P4_2 3.625,-0.025; P4_3 3.625,0.483 | drill 0.8: P5 -2.425,2.73; P6 2.425,2.73
X2-SMD-5.0X3.2X1.3MM = smd 1.778 x 2.032: 1 -2.159,0; 2 2.159,0

### Placement (x,y rotation side)
1  2.29,52.66 180 top
2  2.29,51.14 180 top
3  2.29,49.61 180 top
3.3V  30.58,33.21 0 top
4  1.78,10.67 0 top
5.0V  30.65,29.52 0 top
ANT1  2.41,41.91 0 top
BAT1  7.07,71.06 270 top
C1  33.15,35.65 270 top
C2  63.23,71.62 90 bottom
C3  51.02,7.75 270 top
C4  63.12,7.75 90 top
C5  9.72,50.04 0 top
C6  40.09,38.35 90 top
C7  40.39,8.13 180 top
C9  9.72,45.09 0 top
C10  10.48,42.61 270 top
C11  10.48,47.56 270 top
C12  19.11,52.9 180 top
C13  52.24,29.8 270 bottom
C14  26.92,34.04 270 top
C15  17.14,52.9 180 top
C16  23.88,34.04 90 top
C17  42.42,8.13 180 top
C18  8.23,5.33 180 top
C19  10.39,5.33 180 top
C20  9.4,24.38 0 top
C21  9.14,19.81 180 top
C22  52.15,32.17 270 bottom
C23  63.84,19.64 270 top
C24  6.86,12.13 90 top
C25  45.8,26.59 180 top
C26  64.35,10.75 180 top
C27  5.71,13.59 90 top
C28  5.71,15.11 90 top
C33  37.42,48.34 270 top
C34  45.04,68.57 90 top
C35  41.4,68.57 270 top
C36  32.68,58.84 90 top
D9  52.23,76.79 270 top
D10  49.61,75.35 90 top
D11  43.51,75.35 90 top
D12  46.14,76.79 270 top
D13  57.31,77.04 270 top
D14  54.69,75.6 90 top
D15  41.06,76.79 270 top
D16  38.43,75.35 90 top
GND  37.16,35.73 0 top
J8  59.35,44.36 0 top
L1  12.19,53.4 90 top
L2  9.72,53.02 270 top
L3  7.79,9.14 90 top
L4  44.28,64.59 270 top
Q1  47.46,13.61 270 top
Q2  12.7,20.07 90 top
Q3  17.18,22.77 270 top
Q5  47.39,17.55 270 top
R1  17.27,19.3 90 top
R2  15.66,57.4 90 top
R3  13.61,23.71 90 top
R4  53.59,5.33 180 top
R5  21.4,52.96 180 top
R6  23.37,52.96 180 top
R7  4.45,11.37 0 top
R8  52.18,27.68 270 top
R9  44.8,34.86 0 top
R10  64.6,61.02 270 top
R11  63.42,16.49 180 top
R12  16.85,26.1 90 top
R13  55.37,5.33 180 top
R14  8.72,59.94 90 top
R15  49.01,37.99 0 top
R16  12.36,58.76 90 top
R17  46.85,36.36 0 top
R18  14.99,49.28 90 top
R19  14.99,47.5 90 top
R20  53.61,17.97 180 top
R21  82R  [R0603']  66.44,10.82 90 top
R22  64.16,63.35 270 top
R23  82R  [R0603']  51.39,11.87 90 top
R24  51R  [R0603']  47.65,11.01 0 top
R25  28.7,38.6 0 top
R33  17.27,6.6 90 top
R34  17.27,8.38 270 top
R37  17.36,28.02 270 top
R38  30.46,38.63 0 top
R39  60.7,57.4 0 top
R40  64.85,57.4 0 top
R41  47.49,47.75 270 top
R42  39.2,64.68 90 top
R43  41.74,64.68 270 top
R44  49.95,64.51 90 top
R45  46.82,64.6 270 top
R47  32.59,48.26 90 top
RELOAD  61.47,3.56 180 top
RESET  47.75,3.56 180 top
SD1  55.88,30.05 180 bottom
U1  63.24,69 180 top
U2  14.48,13.46 270 top
U3  37.51,43.35 270 top
U4  14.54,54.17 270 top
U5  21.4,40.64 270 top
U6  4.06,20.83 270 top
U7  29.78,12.57 180 top
U8  55.96,17.27 0 top
U9  58.25,11.94 0 top
U10  42.75,54.26 90 top
U13  25.31,69.93 0 top
U$22  33.36,53.93 90 top
USB1  2.65,5.71 270 top
Y1  9.44,2.03 180 top

### Tracks (layer width: path | path; a pad name or v marks a point on that pad's centre or on a via)
1PPS  (via drill 0.35)
  Top 0.254: U5.4 20.3,32.94 25.81,27.43 v30.82,27.43
  Top 0.305: v30.73,21.25 30.73,20.57 34.54,16.76 34.54,14.14 36.02,12.65 U7.5
  Bottom 0.254: v30.82,27.43 30.82,21.33 v30.73,21.25
3.3V  (via drill 0.35)
  Top 0.254: v13.01,13.79 v13.02,13.78 | U10.25 40.61,57.73 40.61,56.9 41.38,56.13 43.18,56.13 v43.34,55.96 | 43.72,56.51 U10.20 43.72,58.08 43.72,58.79 44.02,59.09 | 44.02,59.09 44.37,58.74 U10.19 | 44.02,59.09 44.02,63.45 L4.2 | v46.9,35.64 R17.2 | v40.89,35.73 40.89,38.32 C6.2 | R22.2 63.45,63.96 v63.07,64.34 | U1.5 61.54,68.74 v61.46,68.74
  Top 0.305: U8.8 61.28,19.64 C23.2
  Top 0.508: 23.45,32.09 v23.28,32.09 | U5.8 24.7,34.1 C16.2 | C16.2 24.64,33.27 23.45,32.09 | 23.45,32.09 23.37,32 30.22,32 | R4.2 R13.2 55.37,6.69 53.17,8.89 v44.2,8.89 C17.2 C7.2 38.33,8.89 U7.2 | 30.22,32 30.58,32 | 30.58,32 31.15,32 | v34.12,32.17 33.95,32 31.15,32 | v1.02,12.19 4.+ | C16.2 C14.2 26.16,34.54 25.8,34.9 U5.9 | 30.58,32 3.3V.TP | 3.3V.TP 30.58,33.12 30.22,32.76 30.22,32 | 3.3V.TP 30.6,33.19 31.15,33.19 31.15,32 | v13.01,13.79 U2.5 10.81,13.83 9.94,13.83 9.7,14.07 9.7,18.43 C21.1 9.22,18.9 9.98,18.9 10.67,19.59 10.67,23.62 | v16.07,15.75 U2.19 | v13.97,32 10.67,28.7 10.67,23.62 | 10.67,23.62 C20.2 | v41.91,30.05 44.36,30.05 | 44.36,30.05 49.78,30.05 | 49.78,30.05 51.81,30.05 v52.83,31.07 | 49.78,30.05 51.47,28.37 R8.2 | U8.8 55.03,25.51 v55.03,25.82 | C23.2 62.86,19.43 | v43.34,55.96 43.72,56.34 43.72,56.51 43.72,58.08 | v43.34,55.96 44.37,56.99 U10.19 | v39.03,56.04 38.52,56.55 U10.28 | v43.34,55.96 44,56.61 46.73,56.61 46.97,56.85 U10.15 47.27,58.16 v51.39,58.16 | 62.99,58.8 59.05,58.8 58.33,58.08 v55.79,58.08 | 62.99,58.8 65.93,58.8 66.66,58.07 66.66,55.23 65.29,53.86 64.32,53.86 63.16,55.03 J8.A2 | 62.99,58.8 63.89,59.7 R10.2 63.45,61.47 R22.2 | R15.2 49.07,37.28 v49.1,37.25 | R9.2 44.8,34.13 v44.78,34.12 | v34.37,53.76 34.14,53.76 31.41,56.49 31.39,56.47 U$22.4 31.25,58.18 C36.1 | 44.36,30.05 45.8,28.62 C25.2
  Top 0.61: v36.74,8.89 38.33,8.89
  Top 1.016: U3.2 U3.TER | U3.TER 41.36,42.67 41.36,38.86 C6.2 41.02,38.19 41.02,35.89 37.98,32.85 v36.74,32.85 | U3.TER 40.68,46.69 40.64,46.73 40.64,47.41 v40.72,47.49
  Bottom 0.152: v1.02,12.19
  Bottom 0.254: v40.89,35.73 40.98,35.73 | v44.78,34.12 42.58,34.12 40.98,35.73 | v49.1,37.25 47,37.25 45.37,35.63 | 45.37,35.63 43.01,35.63 42.91,35.73 40.98,35.73 | 45.37,35.63 46.89,35.63 v46.9,35.64 | v63.07,64.34 63.01,64.4 63.01,67.2 v61.46,68.74 61.46,70.61 C2.2
  Bottom 0.508: v23.28,32.09 14.05,32.09 v13.97,32 9.14,32 1.02,23.88 v1.02,12.19 | v44.2,8.89 43.94,8.89 | v1.02,12.19 | v16.07,15.75 14.1,13.78 v13.02,13.78 | v36.74,32.85 38.44,32.85 41.23,30.05 v41.91,30.05 | v52.83,31.07 52.83,32.09 C22.2 53.99,31.1 SD1.4 | v52.83,31.07 53,30.9 C13.2 | v52.83,31.07 55.85,31.07 SD1.4 | SD1.4 55.54,30.76 54.1,30.76 53.15,29.8 C13.2 | C13.2 53.62,29.19 53.62,28.73 54.44,27.91 54.44,26.41 v55.03,25.82 | v43.34,55.96 43.34,54.8 43.66,54.48 43.66,53.88 43.23,53.45 41.93,53.45 40.72,52.23 39.2,53.76 v34.37,53.76 | 40.72,52.91 40.72,54.35 v39.03,56.04 | v51.39,58.16 55.7,58.16 v55.79,58.08 55.99,57.88 56.26,57.88 57.37,56.77 57.37,55.73 57.59,55.51 57.59,54.54 56.91,53.86 55.94,53.86 54.77,55.03 J8.A1
  Bottom 1.016: v36.74,32.85 34.8,32.85 v34.12,32.17 34.12,11.3 36.53,8.89 43.94,8.89 | 43.94,8.89 44.1,8.89 44.15,8.84 43.99,8.84 43.94,8.89 | 40.72,52.91 40.72,52.23 v40.72,47.49
5.0V  (via drill 0.35)
  Top 0.508: v23.37,30.73 29.97,30.73 | 31.24,30.73 37.34,30.73 37.17,30.9 | v38.61,30.9 37.17,30.9 | v11.18,30.73 7.62,27.18 7.62,17.44 | 37.17,30.9 32.43,35.65 C1.2 32.38,36.58 34.33,38.52 U3.3 | 7.62,15.66 7.62,17.44 | 7.62,15.66 7.62,14.14 | 7.62,14.14 C24.2 7.62,10.2 L3.2 | v45.04,16.66 Q5.2 | 29.97,30.73 30.65,30.06 5.0V.TP 30.65,30.14 31.24,30.73 | 29.97,30.73 31.24,30.73 | 7.62,17.44 6.63,16.45 U6.5V | C28.2 7.07,15.11 7.62,15.66 | C27.2 7.07,13.59 7.62,14.14
  Top 1.016: U3.3 33.77,41.06 28.7,46.14 28.7,58.18 25.01,61.87 19.54,61.87 U13.2 U13.1
  Bottom 0.508: v11.18,30.73 11.26,30.82 23.28,30.82 v23.37,30.73 | v38.61,30.9 38.61,28.53 44.7,22.44 44.7,17 v45.04,16.66
ANTON
  Top 0.305: U5.13 22.5,49.93 23.37,50.8 R6.1
DTR
  Top 0.254: R3.1 12.9,21.13 13.08,20.95 Q2.2 13.84,20.83 14.48,20.83 14.99,20.32 14.99,17.27 15.02,17.23 15.02,15.26 16.91,13.38 17.15,13.14 U2.15
ESP-RXD  (via drill 0.35)
  Top 0.254: R38.2 30.46,37.06 v30.05,36.66 | v29.92,21.25 29.26,20.58 26.92,20.58 25.91,19.57 25.91,9.23 25.52,8.84 U7.37
  Bottom 0.254: v30.05,36.66 29.97,36.57 29.97,21.29 v29.92,21.25
ESP-TXD  (via drill 0.35)
  Top 0.254: R25.2 | R25.2 28.7,37.08 v29.12,36.66 | v29.04,21.25 v29.03,21.25 27,21.25 25.5,19.74 25.5,10.5 25.11,10.11 U7.36
  Bottom 0.254: v29.12,36.66 29.21,36.57 29.21,21.42 v29.04,21.25
ETH_LED1
  Top 0.254: R39.2 59.18,55.03 J8.C1
ETH_LED2
  Top 0.254: R40.2 65.7,55.92 J8.C2
ETH_OSC1
  Top 0.254: U10.23 41.64,58 41.64,58.84 41.06,59.41 38.01,59.41 35.45,56.86 U$22.3
ETH_OSC2
  Top 0.254: U10.24 40.99,58 40.99,58.84 40.83,59 38.19,59 38.18,59.01 38.17,59 37.78,58.61 37.78,50.65 36.4,49.27 32.9,49.27 R47.1
ETH_TPIN+  (via drill 0.35)
  Top 0.254: J8.4 61.25,47.24 60.09,46.07 53.57,46.07 47.75,51.9 | R43.2 41.73,61.63 v43.34,60.02 | v43.34,60.02 | v46.14,52.32 46.56,51.9 47.75,51.9 | U10.13 46.46,50.8 46.46,51.63 46.72,51.9 47.75,51.9
  Bottom 0.254: v46.14,52.32 46.14,55.54 44.19,57.48 44.19,59.18 v43.34,60.02 | v43.34,60.02
ETH_TPIN-  (via drill 0.35)
  Top 0.254: J8.5 58.88,46.56 53.77,46.56 47.35,52.98 46.22,52.98 | R42.1 39.2,61.63 v40.8,60.02 | v42.92,54.18 43.01,54.18 44.21,52.98 46.22,52.98 | 46.22,52.98 46.17,52.93 45.89,52.93 45.53,52.57 45.53,52.07 45.67,51.92 U10.12
  Bottom 0.254: v40.8,60.02 42.08,58.75 42.31,58.51 42.31,54.79 v42.92,54.18
ETH_TPOUT+  (via drill 0.35)
  Top 0.254: R45.2 46.81,61.29 v48.17,59.94 48,59.77 46.74,59.77 45.64,58.66 45.64,57.9 U10.17
  Bottom 0.254: J8.1 63.98,47.66 62.95,46.63 58.03,46.63 54.66,50 54.66,50.63 54.06,51.23 53.2,51.23 53.19,51.22 53,51.22 48.17,56.04 v48.17,59.94
ETH_TPOUT-  (via drill 0.35)
  Top 0.254: R44.1 49.95,59.85 v49.44,59.34 49.44,59.33 49.1,59 46.62,59 46.29,58.66 46.29,57.9 U10.16
  Bottom 0.254: v49.44,59.34 49.44,55.62 53.42,51.64 57.46,51.64 61.44,47.66 J8.3
ETH_VC1+
  Top 0.508: J8.8 54.79,51.59 54.42,51.59 52.72,53.29 52.72,55.51 53.93,56.72 53.93,71.2 51.68,73.44 | D10.C 50.93,74.2 51.68,73.44 | 51.68,73.44 51.68,75.09 D9.A
ETH_VC1-
  Top 0.508: J8.9 54.27,47.66 51.39,50.54 51.39,57.06 52.15,57.82 52.15,70.18 49.52,72.81 43.59,72.81 42.21,74.2 41.91,74.2 | 41.91,74.2 D16.C | 41.91,74.2 41.06,75.05 D15.A
ETH_VC2+
  Top 0.508: J8.10 53.63,51.44 52.06,53.02 52.06,55.78 52.06,55.79 52.06,56.47 53.08,57.48 53.08,70.44 50.04,73.47 49.02,73.47 48.3,74.2 47.07,74.2 | 47.07,74.2 D11.C | 47.07,74.2 46.14,75.13 D12.A
ETH_VC2-
  Top 0.508: J8.11 54.9,54.39 55.05,54.54 55.05,71.09 56.19,72.23 | D13.A 57.31,73.35 56.19,72.23 | D14.C 56.19,72.94 56.19,72.23
GND  (via drill 0.35, 0.51 pad 1.02)  (1 unrouted)
  Top 0.254: R41.2 46.82,46.9 v46.22,47.49 | U10.18 45.04,57.88 v45.04,59.09 | 42.42,58.15 U10.22 42.42,58.93 v42.75,59.26 43.07,58.94 U10.21 | C3.1 52.87,7.75 v52.91,7.79 | U1.2 U1.7 | U1.2 | U1.2 v64.93,68.74 | GND.TP
  Top 0.305: U2.8 12.38,11.84 v12.38,11.87 | U2.20 v19.56,16.39 v19.56,16.38 | USB1.5 4.41,4.42 v4.38,4.45 | C23.1 64.85,19.39 64.85,18.46 v65.02,18.29
  Top 0.406: U8.4 55.36,17.5 v55.33,17.53
  Top 0.508: ANT1.3 2.09,38.86 0.91,38.86 0.76,38.72 0.76,32.01 0.76,32 v0.76,31.24 | ANT1.2 2.41,44.96 0.76,44.96 0.76,46.2 0.76,47.22 v0.76,48.01 | U7.38 22.67,7.57 v22.67,7.56 | U7.1 38.28,7.56 v36.7,7.56 | U7.15 35.58,25.57 v35.58,26.56 | C17.1 v42.42,6.03 | C7.1 v40.39,6.03 | C4.1 62.36,7.62 v60.96,7.62 | v34.33,44.49 U3.1 v34.33,46.78 | C1.1 33.91,36.68 v34.25,37.02 | C28.1 C27.1 v3.94,13.59 | v6.29,17.72 6.29,17.7 U6.GND 3.49,17.7 v3.49,17.72 | USB1.P2 3.17,4.51 v3.17,5.02 | USB1.P1 2.29,6.92 v2.29,7.37 | C21.2 v9.14,21.84 | C20.1 v9.4,26.42 | C18.1 v9.31,4.57 C19.1 | U7.P$1 29.46,15.25 v29.46,14.73 | C24.1 6.04,12.07 R7.1 3.06,12.07 v3.05,12.06 | Q1.2 v45.23,12.72 | R24.1 v45.68,11.01 | C26.1 64.01,9.99 v63.08,9.06 | R21.1 66.44,9.38 v65.95,8.89 | R20.1 53.61,17.27 v52.15,17.27 | R11.1 63.42,14.46 v63.58,14.31 | U10.2 39.17,52.43 v39.11,52.49 | v45.12,49.19 45.02,49.28 U10.11 | C6.1 36.15,38.35 v36.07,38.27 | v9.65,71.88 9.65,71.79 8.92,71.06 BAT1.- 7.76,71.06 9.4,69.42 v9.74,69.42 | C33.2 36.57,48.26 36.51,48.26 | 36.51,48.26 | 36.51,48.26 v34.88,48.26 | C35.1 43.26,69.67 | 43.26,69.67 v43.26,69.93 | C34.1 44.28,68.66 43.26,69.67 | R47.2 v34.88,48.26 | v34.88,48.26 | C36.2 33.4,58.8 33.4,55.94 35.45,53.88 U$22.2 34.76,50.69 v34.76,49.91 | C25.1 45.88,25.74 v45.88,24.64
  Top 0.61: GND.TP v37.16,37.08 | GND.TP v38.52,35.73 | GND.TP v37.16,34.37 | GND.TP v35.81,35.73
  Top 1.016: U13.3 32.13,62.94 v32.13,65.4 | U13.3 30.97,62.93 v30.95,62.95 | U13.3 32.15,60.56 v32.22,60.49
  Bottom 0.254: J8.S2 67.26,44.53 67.26,61.47 63.47,65.26 63.47,67.23 64.93,68.69 | v64.93,68.74 64.93,70.68 C2.1
  Bottom 0.508: SD1.G1 56.48,37.92 | C22.1 51.48,32.09 | SD1.G2 65.98,37.92
  other vias: 38.78,42.08 38.78,40.81 37.51,40.81 37.51,42.08 36.24,42.08 36.24,40.81 36.24,44.62 37.51,44.62 38.78,44.62 38.78,45.89 37.51,45.89 36.24,45.89 29.97,17.78 28.96,17.78 27.94,17.78 26.92,17.78 32,17.78 30.99,17.78 31.5,16.76 30.48,16.76 29.46,16.76 28.45,16.76 27.43,16.76 26.92,15.75 27.94,15.75 28.96,15.75 29.97,15.75 30.99,15.75 32,15.75 31.5,14.73 30.48,14.73 28.45,14.73 27.43,14.73 26.92,13.72 27.94,13.72 28.96,13.72 29.97,13.72 30.99,13.72 32,13.72 31.5,12.7 30.48,12.7 29.46,12.7 28.45,12.7 27.43,12.7 2.48,2.1 2.98,2.1 2.98,9.33 2.41,9.33 8.64,40.89 12.7,55.37 12.7,42.42 7.87,46.23 7.87,51.05 7.87,52.58 7.87,54.1 7.37,40.89 10.16,40.89 11.43,40.89 12.7,40.89 7.87,44.45 7.87,49.53 9.14,55.37 10.92,55.37 12.7,45.47 12.7,43.94 7.87,48.01 14.22,56.01 16,56.01 13.97,52.58 15.24,52.58 12.7,46.99 12.7,48.51 12.7,50.04 12.7,51.56 2.29,48.01 3.56,48.01 5.08,48.01 6.6,48.01 7.37,39.37 7.37,37.85 7.37,36.32 7.37,34.8 7.37,33.27 7.37,32 2.03,31.24 3.3,31.24 4.83,31.24 6.35,31.24 17.53,56.01 19.05,56.01 20.83,56.01 22.35,56.01 23.88,56.01 24.83,55.24 25.65,54.23 25.65,52.7 25.65,51.18 25.65,49.66 25.65,48.32 23.81,49.66 23.81,48.32 23.81,47.05 25.65,47.05 2.22,4.06 3.17,6.48
  pour Top (isolate 0.305): 0,30.48 16.51,30.48 16.51,56.52 0,56.52
  pour Top: 16.51,56.52 28.19,56.52 28.19,30.48 16.51,30.48
  pour Bottom: 0,0.08 0,79.41 47.41,79.41 47.41,46.31 71.11,46.31 71.11,0.08
GPIO0
  Top 0.254: Q2.3 11.43,20.32 11.43,24.38 11.94,24.89 17.36,24.89 | 17.36,24.89 19.05,24.89 19.86,24.08 U7.25 | R12.1 17.36,24.89
LEDA  (via drill 0.35)
  Top 0.254: v56.64,56.47 58.92,56.47 R39.1 | U10.27 39.14,57.83 39.14,57.07 41.27,54.94 49.36,54.94 v50.63,56.21
  Bottom 0.254: v50.63,56.21 50.88,56.47 v56.64,56.47
LEDB  (via drill 0.35)
  Top 0.254: v55.87,57.14 58.15,57.14 59.19,58.18 62.22,58.18 63,57.4 R40.1 | U10.26 39.79,57.83 39.79,57.07 41.51,55.35 48.66,55.35 v50.46,57.14
  Bottom 0.254: v50.46,57.14 v55.87,57.14
MICS_PREHEAT_NOX  (via drill 0.35)
  Top 0.305: Q1.1 44.85,14.5 v43.09,16.25 | v43.09,16.25 | v39.62,16.42 38.32,16.42 U7.8
  Bottom 0.305: v43.09,16.25 39.79,16.25 v39.62,16.42
MICS_PWR  (via drill 0.35)
  Top 0.305: Q5.1 45.36,18.44 44.62,17.69 v43.85,17.69 | v39.79,17.69 38.32,17.69 U7.9
  Bottom 0.305: v43.85,17.69 v39.79,17.69
N$1
  Top 0.254: R16.1 10.41,58.76 3.05,51.39 2.+
N$2
  Top 0.254: U9.C 57.62,13.75 57.62,13.27 58.8,12.09 63.11,12.09 63.51,12.49 65.01,12.49 65.84,11.67 R21.2
N$3
  Top 0.305: C5.2 C11.2 C9.1
N$4
  Top 0.305: C9.2 C10.2 ANT1.1
N$5
  Top 0.305: U4.3 14.04,53.68 L1.2 L2.P$1
N$6  (via drill 0.35)
  Top 0.305: U9.A v59.52,12.7 | v52.24,13.8 51.37,12.93 51.37,12.7
  Top 0.406: 51.37,12.7 R23.2
  Bottom 0.305: v59.52,12.7 58.93,12.11 54.35,12.11 52.66,13.8 v52.24,13.8
N$7
  Top 0.254: 1.+ 8.01,57.63 R14.1
N$8
  Top 0.305: L2.P$2 C5.1
N$9
  Top 0.305: U4.5 16.07,54.17 16.51,54.61 22.43,54.61 R6.2
N$10
  Top 0.305: U4.4 15.04,53.66 C15.2 C12.2 21.4,53.66 R5.2
N$11
  Top 0.254: R18.2 17.53,49.28 19.2,47.6 U5.16
N$12
  Top 0.254: Q3.1 16.12,23.71 R3.2
N$13  (via drill 0.35)
  Top 0.254: Q2.1 13.72,18.29 v14.22,17.78 | v17.27,17.53 17.98,18.23 R1.2
  Bottom 0.254: v14.22,17.78 14.48,17.53 v17.27,17.53
N$14
  Top 0.254: R19.2 17.02,47.5 18.1,46.42 U5.17
N$19  (via drill 3.07)
  other vias: 14.61,3.81
N$20  (via drill 3.07)
  other vias: 67.31,75.56
N$22
  Top 0.254: 3.+ 7.26,53.83 7.26,54.36 10.31,57.4 R2.1
N$23
  Top 0.305: 48.5,13.59 R24.2 | 48.53,13.55 48.6,13.55 51.12,11.03 R23.1
  Top 0.406: 48.5,13.59 Q1.3 48.53,13.55
N$24
  Top 0.305: Q5.3 50.27,15.69 51.96,15.69 53.17,14.48 53.17,10.24 54.27,9.14 56.64,9.14 U9.F U9.G U9.H 61.13,9.49 61.7,10.05 U9.J 62.55,11.52 C26.2
N$25
  Top 0.508: R7.2 4.44,10.67 4.-
N$26  (via drill 0.35)
  Top 0.305: U2.7 10.83,12.51 10.8,12.48 v9.62,12.48 | USB1.2 4.81,6.37 4.42,6.76 4.42,8.54 4.98,9.1 5.97,9.1 v6.01,9.14
  Bottom 0.305: v6.01,9.14 6.87,9.14 9.62,11.9 v9.62,12.48
N$27  (via drill 0.35)
  Top 0.305: v8.89,13.14 10.34,13.14 U2.6 | USB1.3 4.7,5.71 3.96,6.45 3.96,8.73 5.01,9.78 v6.52,9.78
  Bottom 0.305: v8.89,13.14 8.89,12.06 v6.52,9.78
N$28
  Top 0.254: U2.9 9.92,11.19 9.14,10.41 9.14,7.62 8.3,6.77 | 8.3,6.77 | 8.3,6.77 8.23,6.71 C18.2 7.71,6.1 7.28,5.67 Y1.2
N$29
  Top 0.254: U2.10 10.03,10.54 9.65,10.16 9.65,7.62 10.41,6.86 10.41,6.12 | 10.41,6.12 C19.2 | Y1.1 11.6,5.59 11.07,6.12 10.41,6.12
N$30
  Top 0.254: U2.3 13.87,15.09 16.56,12.39 R34.2
N$33
  Top 0.254: U7.35 20.53,11.38 20.07,10.92 20.07,7.37 19.3,6.6 R33.2
N$36  (via drill 0.35)
  Top 0.254: U6.TXD 6.13,21.45 v6.18,21.5 | R37.2 15.41,28.02 v14.39,27.01
  Bottom 0.254: v6.18,21.5 6.18,25.21 8.05,27.08 14.32,27.08 v14.39,27.01
N$37
  Top 0.254: R13.1 56.7,4.63 RELOAD.3
N$38
  Top 0.254: RESET.3 44.07,4.45 45.21,3.3 53.09,3.3 53.59,3.81 R4.1
N$43
  Top 0.508: R43.1 40.47,65.63 | 40.47,65.63 R42.2 | 40.47,65.63 40.47,68.4 C35.2
N$46  (via drill 0.35)
  Top 0.508: v46.98,67.3 47.07,67.3 48.91,65.46 R44.2 | v46.98,67.3 46.98,65.72 R45.1 | v46.98,67.3 46.65,67.3 46.39,67.3 46.1,67.3 L4.1 | v46.98,67.3 45.8,68.49 C34.2
  Bottom 0.508: J8.2 63.79,50.37 58.1,56.06 58.1,57.2 48,67.3 v46.98,67.3
PHY_SPI_CS_IO16  (via drill 0.35)
  Top 0.254: U7.27 21.46,21.54 22.69,22.77 35.44,22.77 36.95,24.28 36.95,27.73 43.94,34.72 43.94,45.55 v43.18,46.31 | U10.9 43.86,50.53 43.86,49.7 44.19,49.36 v44.19,49.02
  Bottom 0.254: v44.19,49.02 44.19,47.32 v43.18,46.31
PHY_SPI_INT_IO25  (via drill 0.35)
  Top 0.254: U7.10 37.74,19.54 37.57,19.54 37.4,19.71 37.4,26.75 37.42,26.75 v37.93,27.26 | U10.4 40.47,49.09 42.5,47.07 42.5,35.73 38.44,31.66 v37.59,31.66
  Bottom 0.254: v37.93,27.26 37.84,27.34 37.84,31.41 v37.59,31.66
PM_RESET  (via drill 0.35)
  Top 0.254: U6.RESET v6.79,22.7 | R12.2 17.68,25.98 21.58,25.98 | 21.58,25.98 23.29,25.98 23.8,25.47 U7.24 | v21.16,25.57 21.58,25.98
  Bottom 0.254: v6.79,22.7 18.3,22.7 v21.16,25.57
PM_SET  (via drill 0.35)
  Top 0.254: U6.SET 6.08,18.95 v6.09,18.96 | U7.26 21.23,22.77 21.23,22.86 21,22.86 18.79,20.66 v18.03,20.66
  Bottom 0.254: v18.03,20.66 7.79,20.66 v6.09,18.96
POE_VIN+
  Top 1.016: D13.C 52.49,78.19 D9.C D12.C D15.C 35.7,77.94 U13.5 U13.6
POE_VIN-
  Top 1.016: D14.A 49.86,76.75 D10.A 46.94,76.5 46.82,76.61 45.45,76.61 45.33,76.5 D11.A 41.86,76.5 41.74,76.61 40.37,76.61 40.25,76.5 D16.A 37.82,76.5 35.59,74.27 21.14,74.27 U13.7 U13.8
RBIAS
  Top 0.254: R41.1 47.49,50.14 U10.14
RELOAD  (via drill 0.35)
  Top 0.254: C4.2 64.64,7.75 65.15,7.24 RELOAD.2 | v40.96,11.37 38.3,11.37 U7.4
  Bottom 0.254: RELOAD.2 63.25,3.81 57.66,3.81 54.36,7.11 48.01,7.11 44.26,10.86 41.47,10.86 v40.96,11.37
RESET  (via drill 0.35)
  Top 0.254: v30.73,10.1 38.27,10.1 U7.3 38.3,10.1 v41.72,10.1 | 18.29,22.77 19.64,22.77 v19.73,22.77 | 18.29,22.77 | Q3.3 18.29,22.77 | RESET.2 51.1,6.05 51.1,6.91 C3.2
  Bottom 0.254: v30.73,10.1 25.46,10.1 21.59,13.97 21.59,21.08 19.89,22.77 v19.73,22.77 | RESET.2 48.39,5.71 44.01,10.1 v41.72,10.1
RF_IN
  Top 0.305: U4.6 15.8,54.67 16.26,55.12 23.62,55.12 24.7,54.04 U5.11
RTS
  Top 0.254: U2.16 17.07,13.79 15.43,15.43 15.43,18.17 R1.1 16.56,20.26 16.17,20.66 Q3.2
RXD0
  Top 0.254: U7.34 20.27,12.65 19.56,11.94 19.56,8.89 19.05,8.38 R34.1
SCL  (via drill 0.35)
  Top 0.254: U1.6 62.97,66.83 62.97,65.49 62.97,65.38 64.86,63.49 | R22.1 64.86,63.49 | v64.93,62.14 65.12,62.32 65.12,63.24 64.86,63.49 | v66.46,59.85 67.36,58.95 67.36,48.51 54.96,36.1 54.96,28.42 48.2,21.66 39.65,21.66 39.53,21.54
  Top 0.305: 39.53,21.54 U7.12
  Bottom 0.254: v66.46,59.85 64.93,61.38 v64.93,62.14 | v64.93,62.14
SD_SPI_CS_IO5  (via drill 0.35)
  Top 0.254: U7.29 21.82,19.54 22,19.54 23.44,20.98 23.44,21.59 24.12,22.27 v36.23,22.27 | v54.35,29.04 54.24,29.04 R8.1 47.47,22.27 v40.04,22.27
  Bottom 0.254: v54.35,29.04 55.74,29.04 SD1.2 | v36.23,22.27 v40.04,22.27
  Bottom 0.305: SD1.2
SDA
  Top 0.254: U1.1 63.49,66.83 63.49,65.49 64.78,64.2 66.11,64.2 66.24,64.07 66.24,62.12 65.31,61.19 R10.1 66.24,61.02 67.93,59.33 67.93,47.61 55.36,35.04 55.36,28.25 48.37,21.25 41.57,21.25 40.59,20.27
  Top 0.305: 40.59,20.27 U7.11
SPI_CLK_IO14  (via drill 0.35)
  Top 0.254: U10.8 43.21,50.53 43.21,48.85 49.01,43.04 R15.1 | R15.1 49.69,38.69 51.56,36.83 | 51.56,36.83 51.9,36.49 48.85,36.49 v48.51,36.15 48.23,36.43 48.23,37.83 49.01,38.62 R15.1 | v54.35,32.51 54.35,34.37 52.53,36.19 52.19,36.19 51.56,36.83 | 39.88,28.19 39.88,29.41 43.43,32.96 46.25,32.96 v47.07,33.78
  Top 0.305: U7.13 39.32,22.81 39.88,23.37 39.88,28.19
  Bottom 0.254: v54.35,32.51 55.57,32.51 SD1.5 | v48.51,36.15 48.51,35.22 v47.07,33.78
SPI_MISO_IO12  (via drill 0.35)
  Top 0.254: U10.6 41.77,48.64 44.8,45.61 R9.1 45.59,35.57 46.73,34.44 | v52.23,34.46 52.22,34.44 46.73,34.44 | U7.14 39.27,25.07 39.27,29.38 43.26,33.37 45.35,33.37 46.42,34.44 46.73,34.44
  Bottom 0.254: v52.23,34.46 52.25,34.44 55.84,34.44 SD1.7
SPI_MOSI_IO15  (via drill 0.35)
  Top 0.254: U10.7 42.56,50.53 42.56,48.68 46.85,44.38 R17.1 | v54.35,29.97 53.6,30.72 53.6,34.03 52.37,35.27 48.53,35.27 47.9,35.9 47.9,36.02 R17.1 | U7.23 25.27,25.42 25.27,25.35 26.2,24.42 35.96,24.42 36.47,24.93 36.47,27.9 42.91,34.34 42.91,35.88 v43.26,36.23 | R17.1 46.78,37 v45.88,37
  Bottom 0.254: v54.35,29.97 55.85,29.97 55.86,29.98 | v43.26,36.23 44.02,37 v45.88,37
  Bottom 0.305: 55.86,29.98 SD1.3
STAT_LED1  (via drill 0.35)
  Top 0.254: v23.88,59.94 23.2,59.27 14.93,59.27 14.25,59.94 R14.2 | U7.33 22.3,13.92 25.06,16.68 25.06,20.23 v26.16,21.33
  Bottom 0.254: v23.88,59.94 28.36,55.46 28.36,23.54 v26.16,21.33
STAT_LED2  (via drill 0.35)
  Top 0.254: v23.88,58.76 R16.2 | U7.31 22.73,16.46 24.55,18.29 24.55,20.74 v25.14,21.33
  Bottom 0.254: v23.88,58.76 23.88,58.51 27.69,54.7 27.69,23.88 v25.14,21.33
STAT_LED3  (via drill 0.35)
  Top 0.254: v23.88,57.4 R2.2 | U7.30 23.07,17.73 24.04,18.71 v24.04,21.33
  Bottom 0.254: v23.88,57.4 26.92,54.36 26.92,24.21 v24.04,21.33
TXD0
  Top 0.254: U2.4 13.5,14.44 15.24,12.7 15.24,7.11 15.75,6.6 R33.1
U1RXD  (via drill 0.35)
  Top 0.152: 19.2,39.26 v19.22,39.28 | 28.67,39.28 R25.1
  Top 0.254: U5.3 19.2,39.26 | v25.57,39.28 28.67,39.28
  Bottom 0.254: v19.22,39.28 v25.57,39.28
U1TXD  (via drill 0.35)
  Top 0.152: 18.11,40.54 v18.12,40.55
  Top 0.254: U5.2 18.11,35.54 18.11,40.54 | R38.1 29.25,40.55 v25.57,40.55
  Bottom 0.254: v18.12,40.55 v25.57,40.55
U2RXD
  Top 0.254: U7.16 34.13,25.55 34.13,26.16 33.61,26.68 19.4,26.68 R37.1
V_BCKP
  Top 0.406: U5.6 22.52,35.81
  Top 0.508: 22.52,35.81 22.52,40.98 23.03,41.49 27.69,41.49 27.69,57.4 24.38,60.7 22.49,60.7 21.82,60.03 15.41,60.03 13.05,62.39 9,62.39 BAT1.+1
  Bottom 0.508: BAT1.+2 BAT1.+1
VBUS
  Top 0.305: USB1.1 7.18,7.01 7.79,7.62 L3.1
VCAP
  Top 0.254: U10.1 38.52,48.68 C33.1
VCC_RF
  Top 0.305: U5.14 R5.1
VOX_RAWA
  Top 0.305: U9.B 58.25,17.53 57.63,18.15 U8.3 55.6,18.15 55.59,18.16 55.07,18.68 R20.2
VOX_RAWB
  Top 0.305: U8.2 U8.1 56.45,19.68 44.74,19.68 39.07,14.01 38.37,14.01 U7.6
VRED_RAWA  (via drill 0.35)
  Top 0.305: U9.D 54.8,14.84 v55.46,15.49 | 61.09,16.3 U8.5 63.12,17.5 63.14,17.52 63.21,17.41 R11.2
  Top 0.406: v61.04,16.26 61.09,16.3
  Bottom 0.305: v55.46,15.49 56.22,16.26 v61.04,16.26
VRED_RAWB
  Top 0.305: U8.7 U8.6 59.91,18.15 57.74,20.32 44.53,20.32 39.39,15.18 38.3,15.18
  Top 0.406: 38.3,15.18 U7.7

### Text on the board
bPlace: Laboratory for Nano-Integrated Systems | Designed By: Henry Gilbert / With support from the AirU Team | Support from: | AirU PoE v1.0 / 11/18/19